# EAGLE design dancepad (EAGLE 5.10)
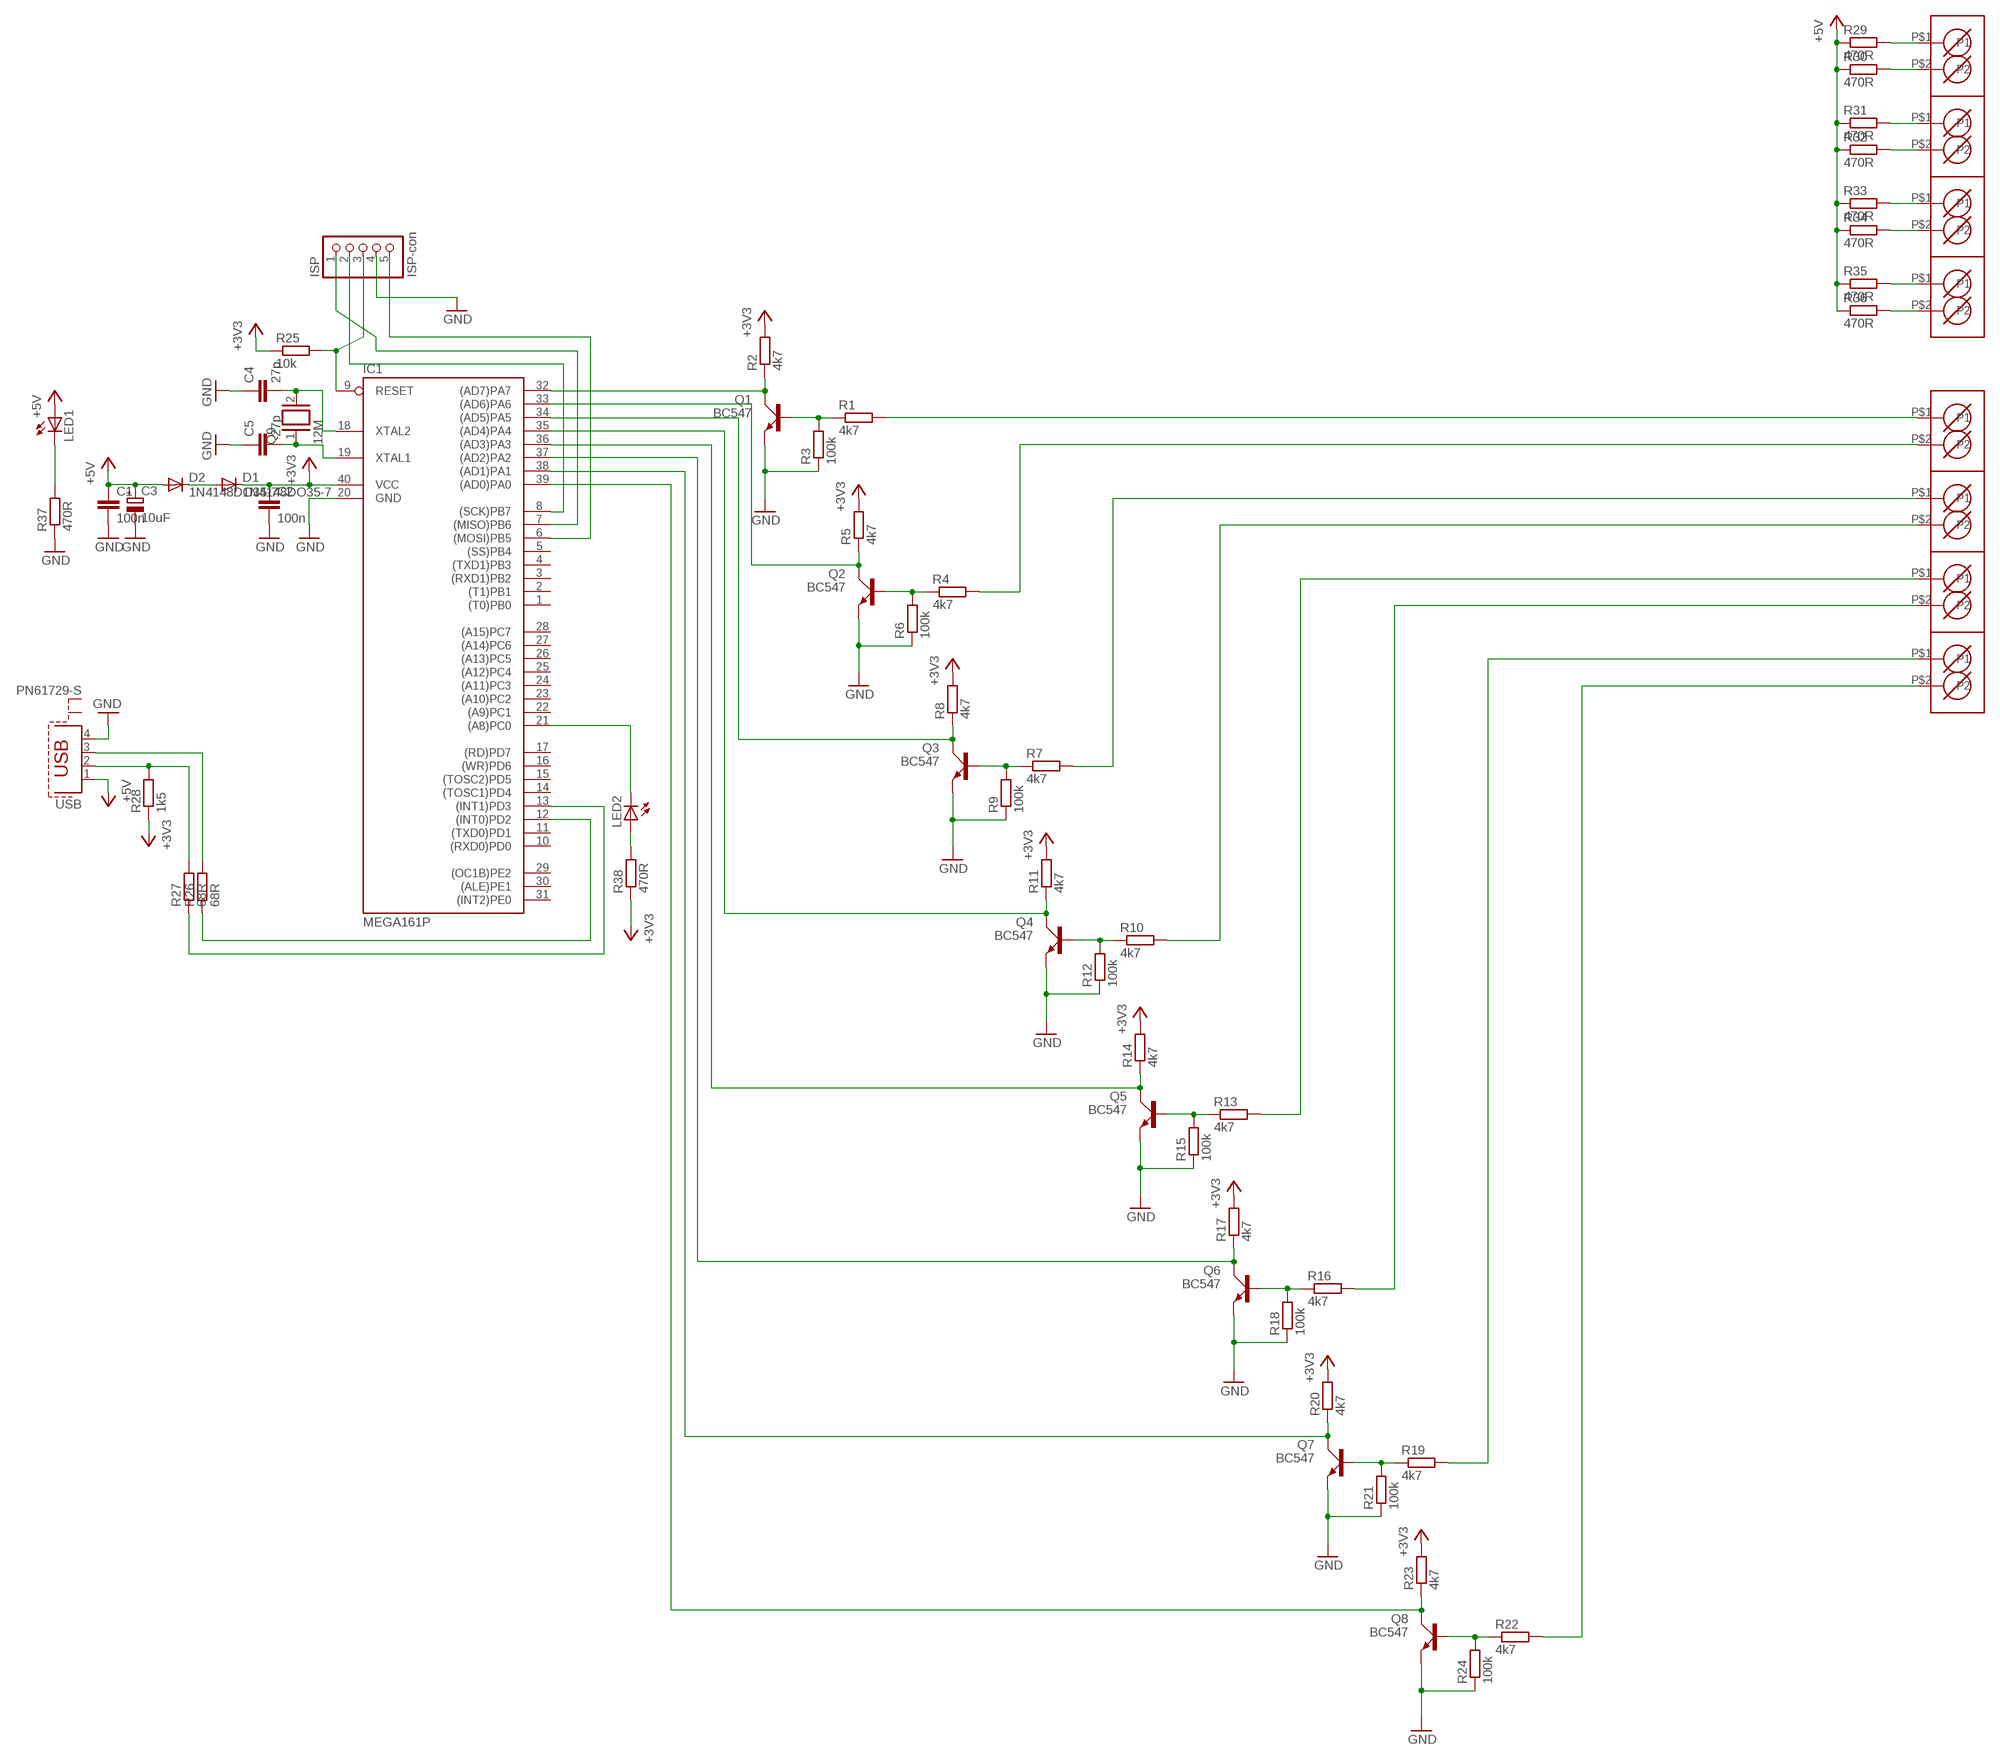
[diagram p0: schematic, sheet 1]

## Parts
C1  100n  C-EU025-025X050  [C025-025X050]
C2  100n  C-EU025-025X050  [C025-025X050]
C3  10uF  CPOL-EUE2,5-6E  [E2,5-6E]
C4  27p  C-EU025-025X050  [C025-025X050]
C5  27p  C-EU025-025X050  [C025-025X050]
D1  1N4148DO35-7  [DO35-7]
D2  1N4148DO35-7  [DO35-7]
IC1  MEGA161P  [DIL40]
ISP  ISP-con  PINHD-1X5  [1X05]
LED1  LED5MM  [LED5MM]
LED2  LED5MM  [LED5MM]
Q1  BC547  [SOT54A]
Q2  BC547  [SOT54A]
Q3  BC547  [SOT54A]
Q4  BC547  [SOT54A]
Q5  BC547  [SOT54A]
Q6  BC547  [SOT54A]
Q7  BC547  [SOT54A]
Q8  BC547  [SOT54A]
Q9  12M  XTAL  [Q]
R1  4k7  R-EU_0207/7  [0207/7]
R2  4k7  R-EU_0207/7  [0207/7]
R3  100k  R-EU_0207/7  [0207/7]
R4  4k7  R-EU_0207/7  [0207/7]
R5  4k7  R-EU_0207/7  [0207/7]
R6  100k  R-EU_0207/7  [0207/7]
R7  4k7  R-EU_0207/7  [0207/7]
R8  4k7  R-EU_0207/7  [0207/7]
R9  100k  R-EU_0207/7  [0207/7]
R10  4k7  R-EU_0207/7  [0207/7]
R11  4k7  R-EU_0207/7  [0207/7]
R12  100k  R-EU_0207/7  [0207/7]
R13  4k7  R-EU_0207/7  [0207/7]
R14  4k7  R-EU_0207/7  [0207/7]
R15  100k  R-EU_0207/7  [0207/7]
R16  4k7  R-EU_0207/7  [0207/7]
R17  4k7  R-EU_0207/7  [0207/7]
R18  100k  R-EU_0207/7  [0207/7]
R19  4k7  R-EU_0207/7  [0207/7]
R20  4k7  R-EU_0207/7  [0207/7]
R21  100k  R-EU_0207/7  [0207/7]
R22  4k7  R-EU_0207/7  [0207/7]
R23  4k7  R-EU_0207/7  [0207/7]
R24  100k  R-EU_0207/7  [0207/7]
R25  10k  R-EU_0207/7  [0207/7]
R26  68R  R-EU_0207/7  [0207/7]
R27  68R  R-EU_0207/7  [0207/7]
R28  1k5  R-EU_0207/7  [0207/7]
R29  470R  R-EU_0207/7  [0207/7]
R30  470R  R-EU_0207/7  [0207/7]
R31  470R  R-EU_0207/7  [0207/7]
R32  470R  R-EU_0207/7  [0207/7]
R33  470R  R-EU_0207/7  [0207/7]
R34  470R  R-EU_0207/7  [0207/7]
R35  470R  R-EU_0207/7  [0207/7]
R36  470R  R-EU_0207/7  [0207/7]
R37  470R  R-EU_0207/7  [0207/7]
R38  470R  R-EU_0207/7  [0207/7]
U$1  SCREWTERM2  [SCREWTERM2]
U$2  SCREWTERM2  [SCREWTERM2]
U$3  SCREWTERM2  [SCREWTERM2]
U$4  SCREWTERM2  [SCREWTERM2]
U$5  SCREWTERM2  [SCREWTERM2]
U$6  SCREWTERM2  [SCREWTERM2]
U$7  SCREWTERM2  [SCREWTERM2]
U$8  SCREWTERM2  [SCREWTERM2]
USB  PN61729-S  [PN61729-S]

## Nets
+3V3: C2.1 D1.C IC1.40(VCC) R2.2 R5.2 R8.2 R11.2 R14.2 R17.2 R20.2 R23.2 R25.1 R28.1 R38.1
+5V: C1.1 C3.+ D2.A LED1.A R29.1 R30.1 R31.1 R32.1 R33.1 R34.1 R35.1 R36.1 USB.1
GND: C1.2 C2.2 C3.- C4.1 C5.1 IC1.20(GND) ISP.4 Q1.E Q2.E Q3.E Q4.E Q5.E Q6.E Q7.E Q8.E R3.1 R6.1 R9.1 R12.1 R15.1 R18.1 R21.1 R24.1 R37.1 USB.4
N$1: IC1.32((AD7)PA7) Q1.C R2.1
N$2: IC1.33((AD6)PA6) Q2.C R5.1
N$3: Q1.B R1.1 R3.2
N$4: R1.2 U$1.P$1(P1)
N$5: D1.A D2.C
N$6: Q2.B R4.1 R6.2
N$7: R4.2 U$1.P$2(P2)
N$8: IC1.34((AD5)PA5) Q3.C R8.1
N$9: Q3.B R7.1 R9.2
N$10: R7.2 U$2.P$1(P1)
N$11: IC1.35((AD4)PA4) Q4.C R11.1
N$12: Q4.B R10.1 R12.2
N$13: R10.2 U$2.P$2(P2)
N$14: IC1.36((AD3)PA3) Q5.C R14.1
N$15: Q5.B R13.1 R15.2
N$16: R13.2 U$3.P$1(P1)
N$17: IC1.37((AD2)PA2) Q6.C R17.1
N$18: Q6.B R16.1 R18.2
N$19: R16.2 U$3.P$2(P2)
N$20: IC1.38((AD1)PA1) Q7.C R20.1
N$21: Q7.B R19.1 R21.2
N$22: R19.2 U$4.P$1(P1)
N$23: IC1.39((AD0)PA0) Q8.C R23.1
N$24: Q8.B R22.1 R24.2
N$25: R22.2 U$4.P$2(P2)
N$26: C4.2 IC1.18(XTAL2) Q9.2
N$27: C5.2 IC1.19(XTAL1) Q9.1
N$28: IC1.9(RESET) ISP.3 R25.2
N$29: IC1.7((MISO)PB6) ISP.1
N$30: IC1.6((MOSI)PB5) ISP.5
N$31: IC1.8((SCK)PB7) ISP.2
N$32: IC1.12((INT0)PD2) R26.1
N$33: R27.2 R28.2 USB.2
N$34: R26.2 USB.3
N$35: LED1.K(C) R37.2
N$36: IC1.13((INT1)PD3) R27.1
N$37: R29.2 U$8.P$1(P1)
N$38: R30.2 U$8.P$2(P2)
N$39: R31.2 U$7.P$1(P1)
N$40: R32.2 U$7.P$2(P2)
N$41: R33.2 U$6.P$1(P1)
N$42: R34.2 U$6.P$2(P2)
N$43: R35.2 U$5.P$1(P1)
N$44: R36.2 U$5.P$2(P2)
N$45: LED2.A R38.2
N$46: IC1.21((A8)PC0) LED2.K(C)
Unconnected: IC1.1((T0)PB0) IC1.2((T1)PB1) IC1.3((RXD1)PB2) IC1.4((TXD1)PB3) IC1.5((SS)PB4) IC1.10((RXD0)PD0) IC1.11((TXD0)PD1) IC1.14((TOSC1)PD4) IC1.15((TOSC2)PD5) IC1.16((WR)PD6) IC1.17((RD)PD7) IC1.22((A9)PC1) IC1.23((A10)PC2) IC1.24((A11)PC3) IC1.25((A12)PC4) IC1.26((A13)PC5) IC1.27((A14)PC6) IC1.28((A15)PC7) IC1.29((OC1B)PE2) IC1.30((ALE)PE1) IC1.31((INT2)PE0) USB.S1 USB.S2

## Library data of the parts
C1 C2 C4 C5 = rcl:C-EU: CAPACITOR, European symbol
C3 = rcl:CPOL-EU: POLARIZED CAPACITOR, European symbol
D1 D2 = diode:1N4148: DIODE high speed (Philips)
IC1 = atmel:MEGA161*P: MICROCONTROLLER 16 Kbytes FLASH 512 bytes EEPROM 1 Kbytes SRAM dual UART hardware multiplier Source: avr.lbr
ISP = pinhead:PINHD-1X5: PIN HEADER
LED1 LED2 = led:LED: LED OSRAM: - CHIPLED LG R971, LG N971, LY N971, LG Q971, LY Q971, LO R971, LY R971 LH N974, LH R974 LS Q976, LO Q976, LY Q976 LO Q996 - Hyper CHIPLED LW Q18S LB Q993, LB Q99A, LB R99A - SideLED LS A670, LO A670, LY A670, LG A670, LP A670 LB A673, LV A673, LT A673, LW A673 LH A674 LY A675 LS A676, LA A676, LO A676, LY A676, LW A676 LS A679, LY A679, LG A679 - Hyper Micro SIDELED® LS Y876, LA Y876, LO Y876, LY Y876 LT Y87S - SmartLED LW L88C, LW L88S LB L89C, LB L89S, LG L890 LS L89K, LO L89K, LY L89K LS L896, LA L896, LO L896, LY L896 - TOPLED LS T670, LO T670, LY T670, LG T670, LP T670 LSG T670, LSP T670, LSY T670, LOP T670, LYG T670 LG T671, LOG T671, LSG T671 LB T673, LV T673, LT T673, LW T673 LH T674 LS T676, LA T676, LO T676, LY T676, LB T676, LH T676, LSB T676, LW T676 LB T67C, LV T67C, LT T67C, LS T67K, LO T67K, LY T67K, LW E67C LS E67B, LA E67B, LO E67B, LY E67B, LB E67C, LV E67C, LT E67C LW T67C LS T679, LY T679, LG T679 LS T770, LO T770, LY T770, LG T770, LP T770 LB T773, LV T773, LT T773, LW T773 LH T774 LS E675, LA E675, LY E675, LS T675 LS T776, LA T776, LO T776, LY T776, LB T776 LHGB T686 LT T68C, LB T68C - Hyper Mini TOPLED® LB M676 - Mini TOPLED Santana® LG M470 LS M47K, LO M47K, LY M47K Source: http://www.osram.convergy.de LUXEON: - LUMILED® LXK2-PW12-R00, LXK2-PW12-S00, LXK2-PW14-U00, LXK2-PW14-V00 LXK2-PM12-R00, LXK2-PM12-S00, LXK2-PM14-U00 LXK2-PE12-Q00, LXK2-PE12-R00, LXK2-PE12-S00, LXK2-PE14-T00, LXK2-PE14-U00 LXK2-PB12-K00, LXK2-PB12-L00, LXK2-PB12-M00, LXK2-PB14-N00, LXK2-PB14-P00, LXK2-PB14-Q00 LXK2-PR12-L00, LXK2-PR12-M00, LXK2-PR14-Q00, LXK2-PR14-R00 LXK2-PD12-Q00, LXK2-PD12-R00, LXK2-PD12-S00 LXK2-PH12-R00, LXK2-PH12-S00 LXK2-PL12-P00, LXK2-PL12-Q00, LXK2-PL12-R00 Source: www.luxeon.com KINGBRIGHT: KA-3528ASYC Source: www.kingbright.com
Q1-Q8 = transistor-small-signal:BC547: NPN TRANSISTOR
Q9 = special:XTAL: CRYSTAL
R1-R38 = rcl:R-EU_: RESISTOR, European symbol
U$1-U$8 = extra:SCREWTERM2
USB = con-berg:PN61729-S: BERG USB connector

## Board
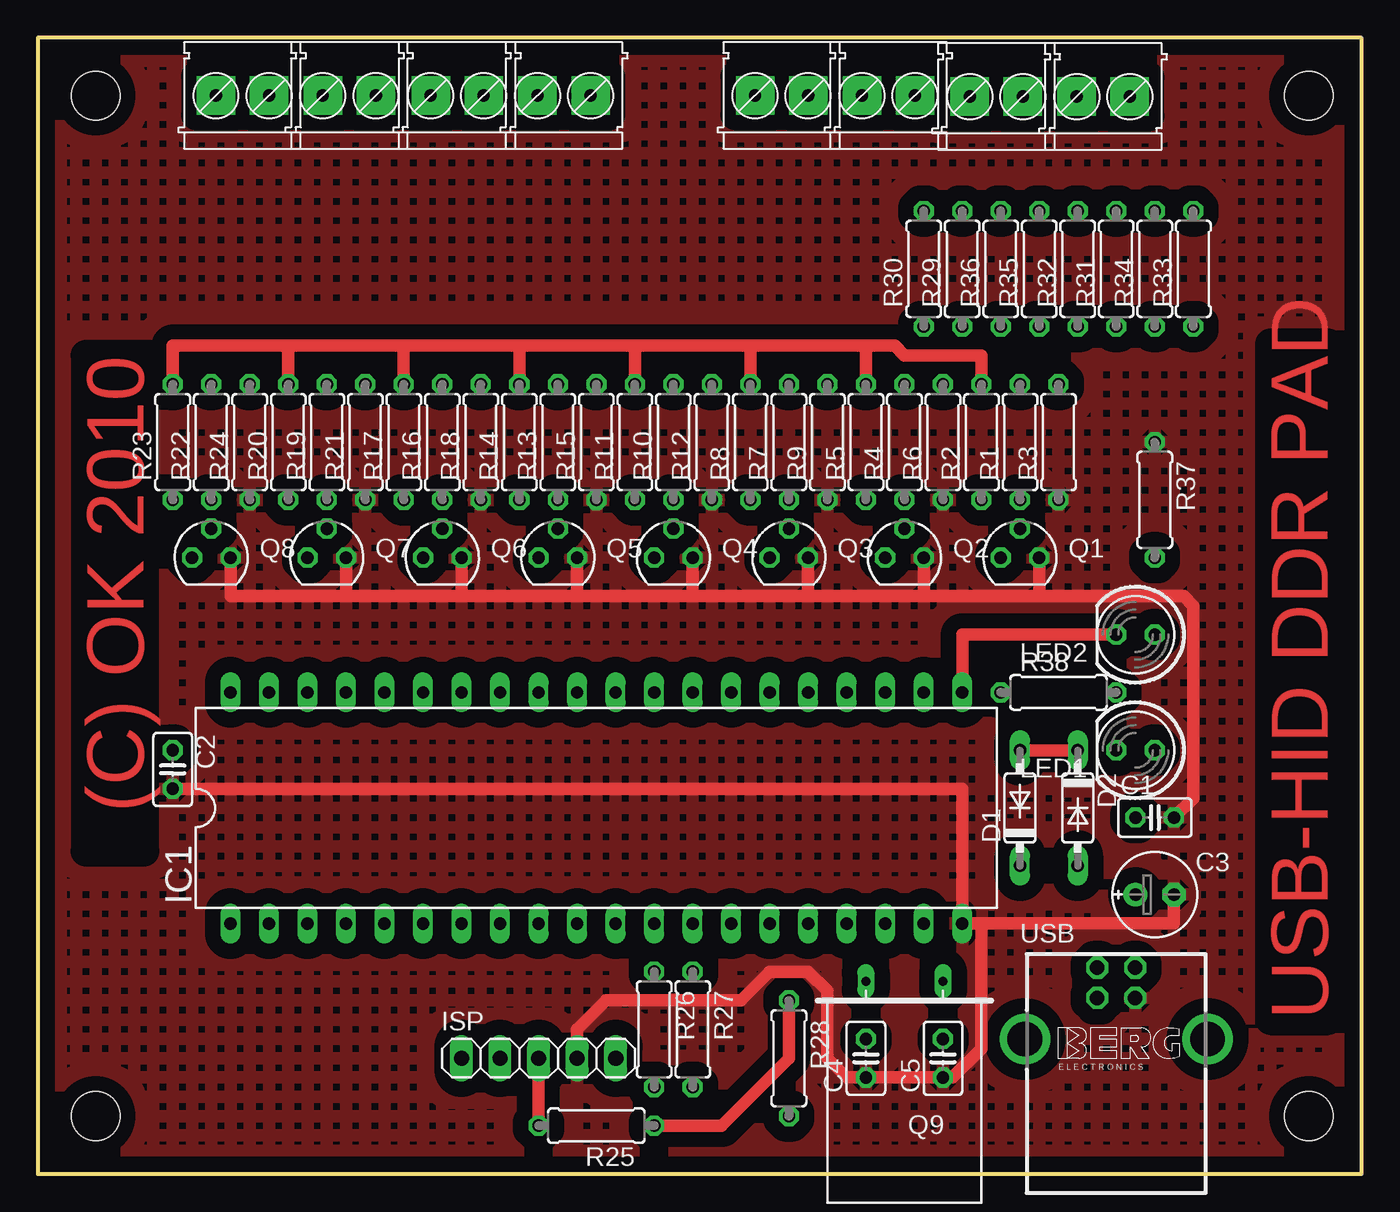
[diagram p1: board, top side]
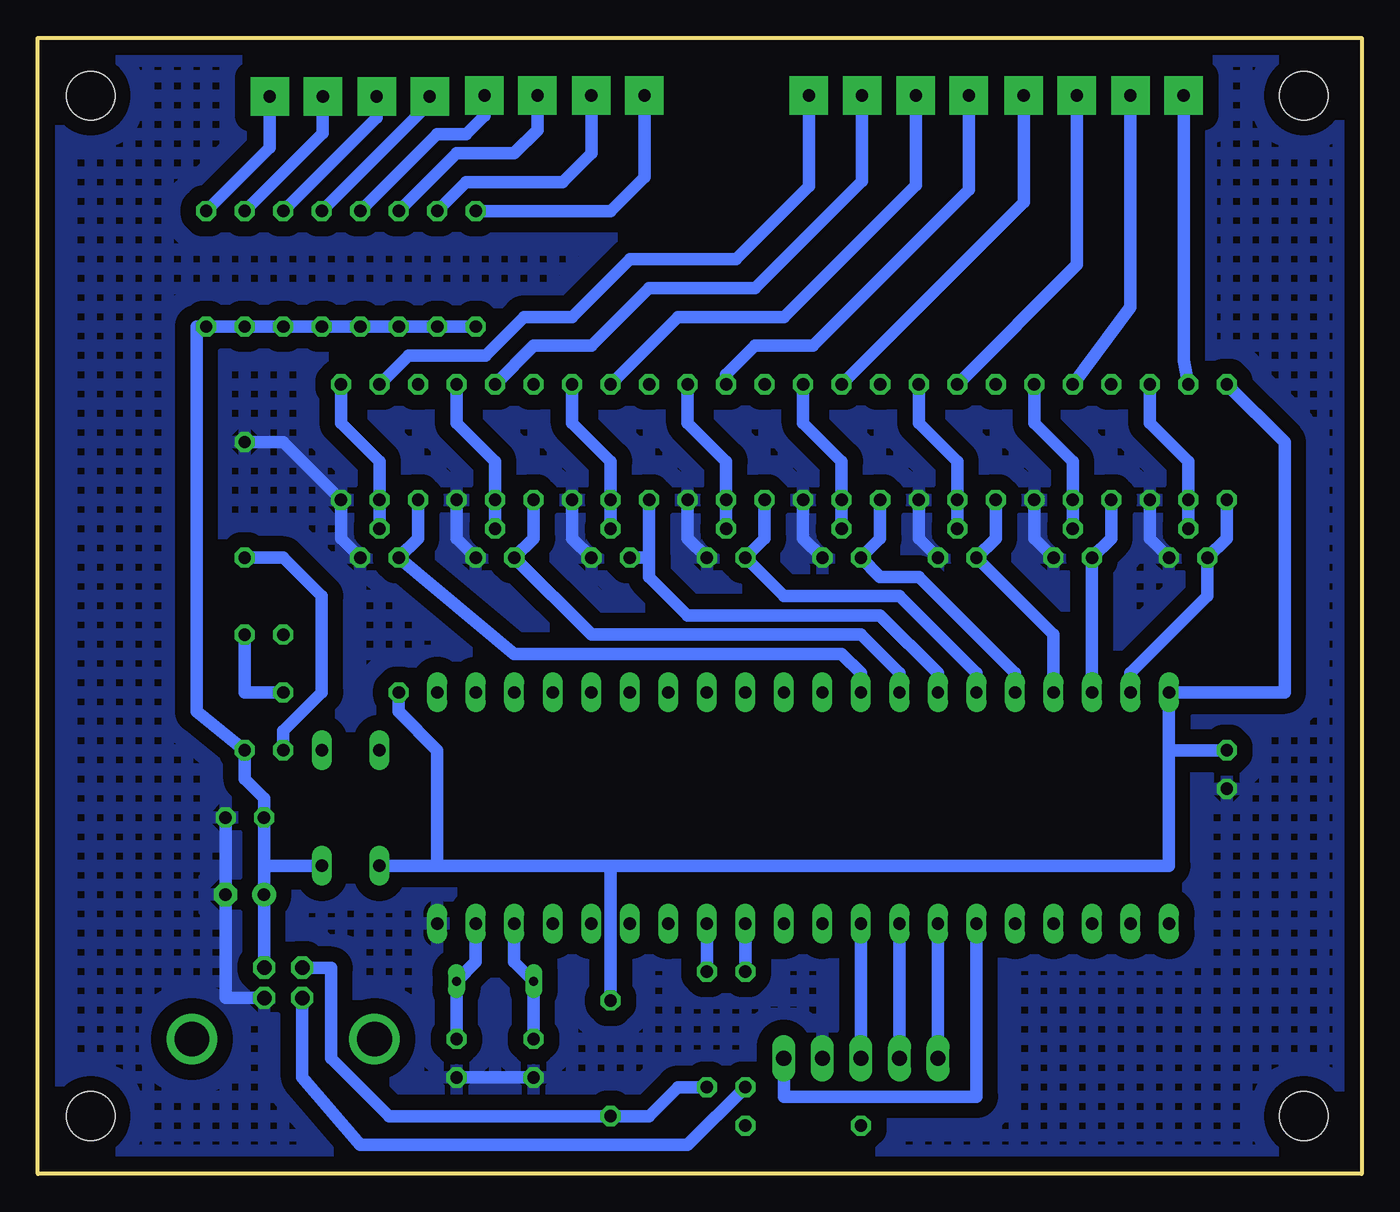
[diagram p2: board, bottom side, seen from below]

Size 87.3 x 74.92 mm. Coordinates in mm from the lower left corner, seen from the top.
Outline: 0,0 87.3,0 87.3,74.92 0,74.92 0,0
Copper layers (1*16): Top 0.035mm / dielectric 1.5mm / Bottom 0.035mm
Design rules "default": minimum track width 10mil, minimum drill 24mil, track to track 8mil, track to pad 8mil, pad to pad 8mil, via to via 8mil, smd to smd 8mil, copper to edge 40mil, drill to drill 8mil, minimum pad ring 10mil, minimum via ring 8mil, stop-mask expansion 4mil, vias tented up to drill 0mil, thermal gap 10mil
Holes 3.2 mm at 3.81,71.12 83.82,71.12 83.82,3.81 3.81,3.81

### Footprints (pad centres in the part's own frame; a part is rotated, then mirrored left to right if it is on the bottom)
C025-025X050 = drill 0.813 octagon: 1 -1.27,0; 2 1.27,0
E2,5-6E = drill 0.813 pad 1.575 round: + -1.27,0 | drill 0.813 pad 1.575 octagon: - 1.27,0
DO35-7 = drill 0.813 long: A 3.81,0; C -3.81,0
DIL40 = drill 0.813 long: 1 -24.13,-7.62; 2 -21.59,-7.62; 3 -19.05,-7.62; 4 -16.51,-7.62; 5 -13.97,-7.62; 6 -11.43,-7.62; 7 -8.89,-7.62; 8 -6.35,-7.62; 9 -3.81,-7.62; 10 -1.27,-7.62; 11 1.27,-7.62; 12 3.81,-7.62; 13 6.35,-7.62; 14 8.89,-7.62; 15 11.43,-7.62; 16 13.97,-7.62; 17 16.51,-7.62; 18 19.05,-7.62; 19 21.59,-7.62; 20 24.13,-7.62; 21 24.13,7.62; 22 21.59,7.62; 23 19.05,7.62; 24 16.51,7.62; 25 13.97,7.62; 26 11.43,7.62; 27 8.89,7.62; 28 6.35,7.62; 29 3.81,7.62; 30 1.27,7.62; 31 -1.27,7.62; 32 -3.81,7.62; 33 -6.35,7.62; 34 -8.89,7.62; 35 -11.43,7.62; 36 -13.97,7.62; 37 -16.51,7.62; 38 -19.05,7.62; 39 -21.59,7.62; 40 -24.13,7.62
1X05 = drill 1.016 long: 1 -5.08,0; 2 -2.54,0; 3 0,0; 4 2.54,0; 5 5.08,0
LED5MM = drill 0.813 octagon: A -1.27,0; K 1.27,0
SOT54A = drill 0.813 octagon: B 0,1.905; C -1.27,0; E 1.27,0
Q = drill 0.61 long: 1 -2.54,-7.62; 2 2.54,-7.62
0207/7 = drill 0.813 octagon: 1 -3.81,0; 2 3.81,0
SCREWTERM2 = drill 0.8 pad 2.54 square: P$1 0,0; P$2 3.5,0
PN61729-S = drill 0.95 octagon: 1 1.25,4.71; 2 -1.25,4.71; 3 -1.25,2.71; 4 1.25,2.71 | drill 2.3 pad 2.9 round: S1 -6.02,0; S2 6.02,0

### Placement (x,y rotation side)
C1  73.66,23.5 0 top
C2  8.89,26.67 270 top
C3  73.66,18.41 0 top
C4  54.61,7.62 90 top
C5  59.69,7.62 90 top
D1  64.77,24.13 90 top
D2  68.58,24.13 270 top
IC1  36.83,24.13 0 top
ISP  33.02,7.62 0 top
LED1  72.39,27.94 180 top
LED2  72.39,35.56 180 top
Q1  64.77,40.64 0 top
Q2  57.15,40.64 0 top
Q3  49.53,40.64 0 top
Q4  41.91,40.64 0 top
Q5  34.29,40.64 0 top
Q6  26.67,40.64 0 top
Q7  19.05,40.64 0 top
Q8  11.43,40.64 0 top
Q9  57.15,5.08 180 top
R1  64.77,48.26 90 top
R2  62.23,48.26 90 top
R3  67.31,48.26 90 top
R4  57.15,48.26 90 top
R5  54.61,48.26 90 top
R6  59.69,48.26 90 top
R7  49.53,48.26 90 top
R8  46.99,48.26 90 top
R9  52.07,48.26 90 top
R10  41.91,48.26 90 top
R11  39.37,48.26 90 top
R12  44.45,48.26 90 top
R13  34.29,48.26 90 top
R14  31.75,48.26 90 top
R15  36.83,48.26 90 top
R16  26.67,48.26 90 top
R17  24.13,48.26 90 top
R18  29.21,48.26 90 top
R19  19.05,48.26 90 top
R20  16.51,48.26 90 top
R21  21.59,48.26 90 top
R22  11.43,48.26 90 top
R23  8.89,48.26 90 top
R24  13.97,48.26 90 top
R25  36.83,3.17 180 top
R26  40.64,9.53 270 top
R27  43.18,9.53 270 top
R28  49.53,7.62 270 top
R29  60.96,59.69 90 top
R30  58.42,59.69 90 top
R31  71.12,59.69 90 top
R32  68.58,59.69 90 top
R33  76.2,59.69 90 top
R34  73.66,59.69 90 top
R35  66.04,59.69 90 top
R36  63.5,59.69 90 top
R37  73.66,44.45 270 top
R38  67.31,31.75 0 top
U$1  36.45,71.12 180 top
U$2  29.4,71.12 180 top
U$3  22.29,71.12 180 top
U$4  15.24,71.12 180 top
U$5  57.85,71.12 180 top
U$6  72.01,71.06 180 top
U$7  64.96,71.06 180 top
U$8  50.8,71.12 180 top
USB  71.12,8.89 0 top

### Tracks (layer width: path | path; a pad name or v marks a point on that pad's centre or on a via)
+3V3
  Top 0.813: R25.1 45.08,3.17 49.53,7.62 R28.1 | R23.2 8.89,54.61 16.51,54.61 | 16.51,54.61 24.13,54.61 | 24.13,54.61 31.75,54.61 | 31.75,54.61 39.37,54.61 | 39.37,54.61 46.99,54.61 | 46.99,54.61 54.61,54.61 | 54.61,54.61 56.52,54.61 57.15,53.98 62.23,53.98 R2.2 | 54.61,54.61 R5.2 | 46.99,54.61 R8.2 | 39.37,54.61 R11.2 | 31.75,54.61 R14.2 | 16.51,54.61 R20.2 | 24.13,54.61 R17.2
  Bottom 0.813: 49.53,20.32 12.7,20.32 IC1.40 | 49.53,20.32 60.96,20.32 | 60.96,20.32 D1.C | R38.1 63.5,30.48 60.96,27.94 60.96,20.32 | 49.53,20.32 R28.1 | IC1.40 12.7,27.94 C2.1 | R23.2 5.08,48.26 5.08,31.75 IC1.40
+5V
  Bottom 0.813: R30.1 R29.1 R36.1 R35.1 R32.1 R31.1 R34.1 R33.1 76.83,55.88 76.83,30.48 LED1.A 73.66,26.04 72.39,24.77 C1.1 72.39,20.32 | USB.1 72.39,13.6 C3.+ 72.39,20.32 | 72.39,20.32 D2.A
GND
  Top 0.813: 66.04,38.1 Q1.E | 66.04,38.1 58.42,38.1 | 58.42,38.1 Q2.E | 20.32,38.1 12.7,38.1 Q8.E | 27.94,38.1 20.32,38.1 | 35.56,38.1 27.94,38.1 | 43.18,38.1 35.56,38.1 | 50.8,38.1 43.18,38.1 | 58.42,38.1 50.8,38.1 | 20.32,38.1 Q7.E | 27.94,38.1 Q6.E | 35.56,38.1 Q5.E | 43.18,38.1 Q4.E | 50.8,38.1 Q3.E | ISP.4 35.56,9.53 37.47,11.43 46.36,11.43 48.26,13.34 50.8,13.34 52.07,12.06 52.07,7.62 53.34,6.35 C4.1 C5.1 60.33,6.35 62.23,8.26 62.23,16.51 | 62.23,16.51 IC1.20 60.96,25.4 C2.2 | 62.23,16.51 74.93,16.51 C3.- | 66.04,38.1 75.56,38.1 76.2,37.47 76.2,24.77 C1.2
  Bottom 0.813: Q1.E 67.31,41.91 R3.1 71.12,48.26 R37.1 | R6.1 59.69,41.91 Q2.E | R9.1 52.07,41.91 Q3.E | R12.1 44.45,41.91 Q4.E | R15.1 36.83,41.91 Q5.E | R18.1 29.21,41.91 Q6.E | R21.1 21.59,41.91 Q7.E | C5.1 C4.1 | R24.1 13.97,41.91 Q8.E | USB.4 74.93,11.6 C3.- C1.2
  pour Bottom (isolate 1.016, hatched): 0.64,74.3 0.64,0.64 86.99,0.64 86.99,74.3
  pour Top (isolate 1.016, hatched): 0.64,74.3 0.64,0.64 86.36,0.64 86.99,74.3
N$1
  Bottom 0.813: IC1.32 33.02,33.02 34.29,34.29 55.88,34.29 Q1.C 62.23,41.91 R2.1
N$2
  Bottom 0.813: IC1.33 30.48,33.02 33.02,35.56 50.8,35.56 Q2.C 54.61,41.91 R5.1
N$3
  Bottom 0.813: Q1.B R1.1 64.77,46.99 67.31,49.53 R3.2
N$4
  Bottom 0.813: U$1.P$1 36.45,65.15 41.28,60.33 48.26,60.33 52.07,56.52 55.24,56.52 57.78,53.98 62.86,53.98 R1.2
N$5
  Top 0.813: D1.A D2.C
N$6
  Bottom 0.813: Q2.B R4.1 57.15,46.99 59.69,49.53 R6.2
N$7
  Bottom 0.813: U$1.P$2 32.95,65.48 40,58.42 46.99,58.42 50.8,54.61 54.61,54.61 R4.2
N$8
  Bottom 0.813: 46.99,40.64 R8.1 | 46.99,40.64 Q3.C | 46.99,40.64 46.99,39.37 44.45,36.83 31.75,36.83 27.94,33.02 IC1.34
N$9
  Bottom 0.813: Q3.B R7.1 49.53,46.99 52.07,49.53 R9.2
N$10
  Bottom 0.813: U$2.P$1 29.4,65.22 38.1,56.52 45.08,56.52 R7.2
N$11
  Bottom 0.813: IC1.35 25.4,33.02 30.48,38.1 38.1,38.1 Q4.C 39.37,41.91 R11.1
N$12
  Bottom 0.813: Q4.B R10.1 41.91,46.99 44.45,49.53 R12.2
N$13
  Bottom 0.813: U$2.P$2 25.9,64.9 36.2,54.61 40,54.61 41.91,52.7 R10.2
N$14
  Bottom 0.813: IC1.36 22.86,33.02 29.21,39.37 31.75,39.37 Q5.C 31.75,41.91 R14.1
N$15
  Bottom 0.813: Q5.B R13.1 34.29,46.99 36.83,49.53 R15.2
N$16
  Bottom 0.813: U$3.P$1 22.29,64.07 R13.2
N$17
  Bottom 0.813: IC1.37 20.32,35.56 Q6.C 24.13,41.91 R17.1
N$18
  Bottom 0.813: Q6.B R16.1 26.67,46.99 29.21,49.53 R18.2
N$19
  Bottom 0.813: U$3.P$2 18.79,59.95 R16.2
N$20
  Bottom 0.813: IC1.38 Q7.C 16.51,41.91 R20.1
N$21
  Bottom 0.813: Q7.B R19.1 19.05,46.99 21.59,49.53 R21.2
N$22
  Bottom 0.813: R19.2 15.24,57.15 U$4.P$1
N$23
  Bottom 0.813: IC1.39 15.24,33.02 10.16,38.1 Q8.C 8.89,41.91 R23.1
N$24
  Bottom 0.813: Q8.B R22.1 11.43,46.99 13.97,49.53 R24.2
N$25
  Bottom 0.813: R22.2 11.74,53.65 U$4.P$2
N$26
  Bottom 0.813: IC1.18 55.88,13.97 Q9.2 C4.2
N$27
  Bottom 0.813: IC1.19 58.42,13.97 Q9.1 C5.2
N$28
  Top 0.813: R25.2 ISP.3
  Bottom 0.813: ISP.3 IC1.9
N$29
  Bottom 0.813: ISP.1 IC1.7
N$30
  Bottom 0.813: IC1.6 25.4,5.08 38.1,5.08 ISP.5
N$31
  Bottom 0.813: ISP.2 IC1.8
N$32
  Bottom 0.813: R26.1 IC1.12
N$33
  Bottom 0.813: USB.2 67.94,13.58 67.94,7.62 64.13,3.81 R28.2 46.99,3.81 45.08,5.71 R27.2
N$34
  Bottom 0.813: USB.3 69.87,6.37 66.04,1.91 44.45,1.91 R26.2
N$35
  Bottom 0.813: R37.2 71.12,40.64 68.58,38.1 68.58,31.75 71.12,29.21 LED1.K
N$36
  Bottom 0.813: R27.1 IC1.13
N$37
  Bottom 0.813: U$8.P$1 50.8,67.31 52.7,65.41 59.05,65.41 R29.2
N$38
  Bottom 0.813: U$8.P$2 47.3,65.73 49.53,63.5 R30.2
N$39
  Bottom 0.813: U$7.P$1 64.96,69.66 R31.2
N$40
  Bottom 0.813: U$7.P$2 61.46,70.62 R32.2
N$41
  Bottom 0.813: U$6.P$1 72.01,67.69 R33.2
N$42
  Bottom 0.813: U$6.P$2 68.51,68.65 R34.2
N$43
  Bottom 0.813: U$5.P$1 57.85,69.79 59.05,68.58 60.96,68.58 R35.2
N$44
  Bottom 0.813: U$5.P$2 54.35,68.84 55.88,67.31 59.69,67.31 R36.2
N$45
  Bottom 0.813: R38.2 73.66,31.75 LED2.A
N$46
  Top 0.813: LED2.K 60.96,35.56 IC1.21

### Text on the board
Top: (C) OK 2010 | USB-HID DDR PAD